# EAGLE schematic 4PIN_FAN (EAGLE 6.6.0)
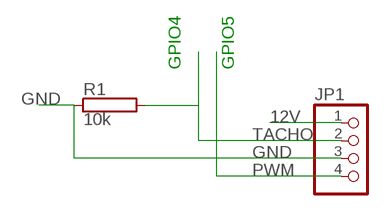
[diagram p0: schematic, sheet 1]

## Parts
JP1  PINHD-1X4  [1X04]
R1  10k  RAC04  [AC04]

## Nets
12V: JP1.1
GND: JP1.3 R1.1
PWM: JP1.4
TACHO: JP1.2 R1.2

## Notes on the sheet
- GPIO4 | GPIO5

## Library data of the parts
JP1 = pinhead:PINHD-1X4: PIN HEADER
R1 = resistor-power:R: Power Resitor; OC_FARNELL: unknown; OC_NEWARK: unknown